# EasyEDA schematic SCH_Scheda_PSEIOT_2025-02-07.json
TITLE: Sheet_1; REV: 1.0; Date: 2024-11-25; Sheet: 1/1; Drawn By: steve.projects.lab; Company: Your Company
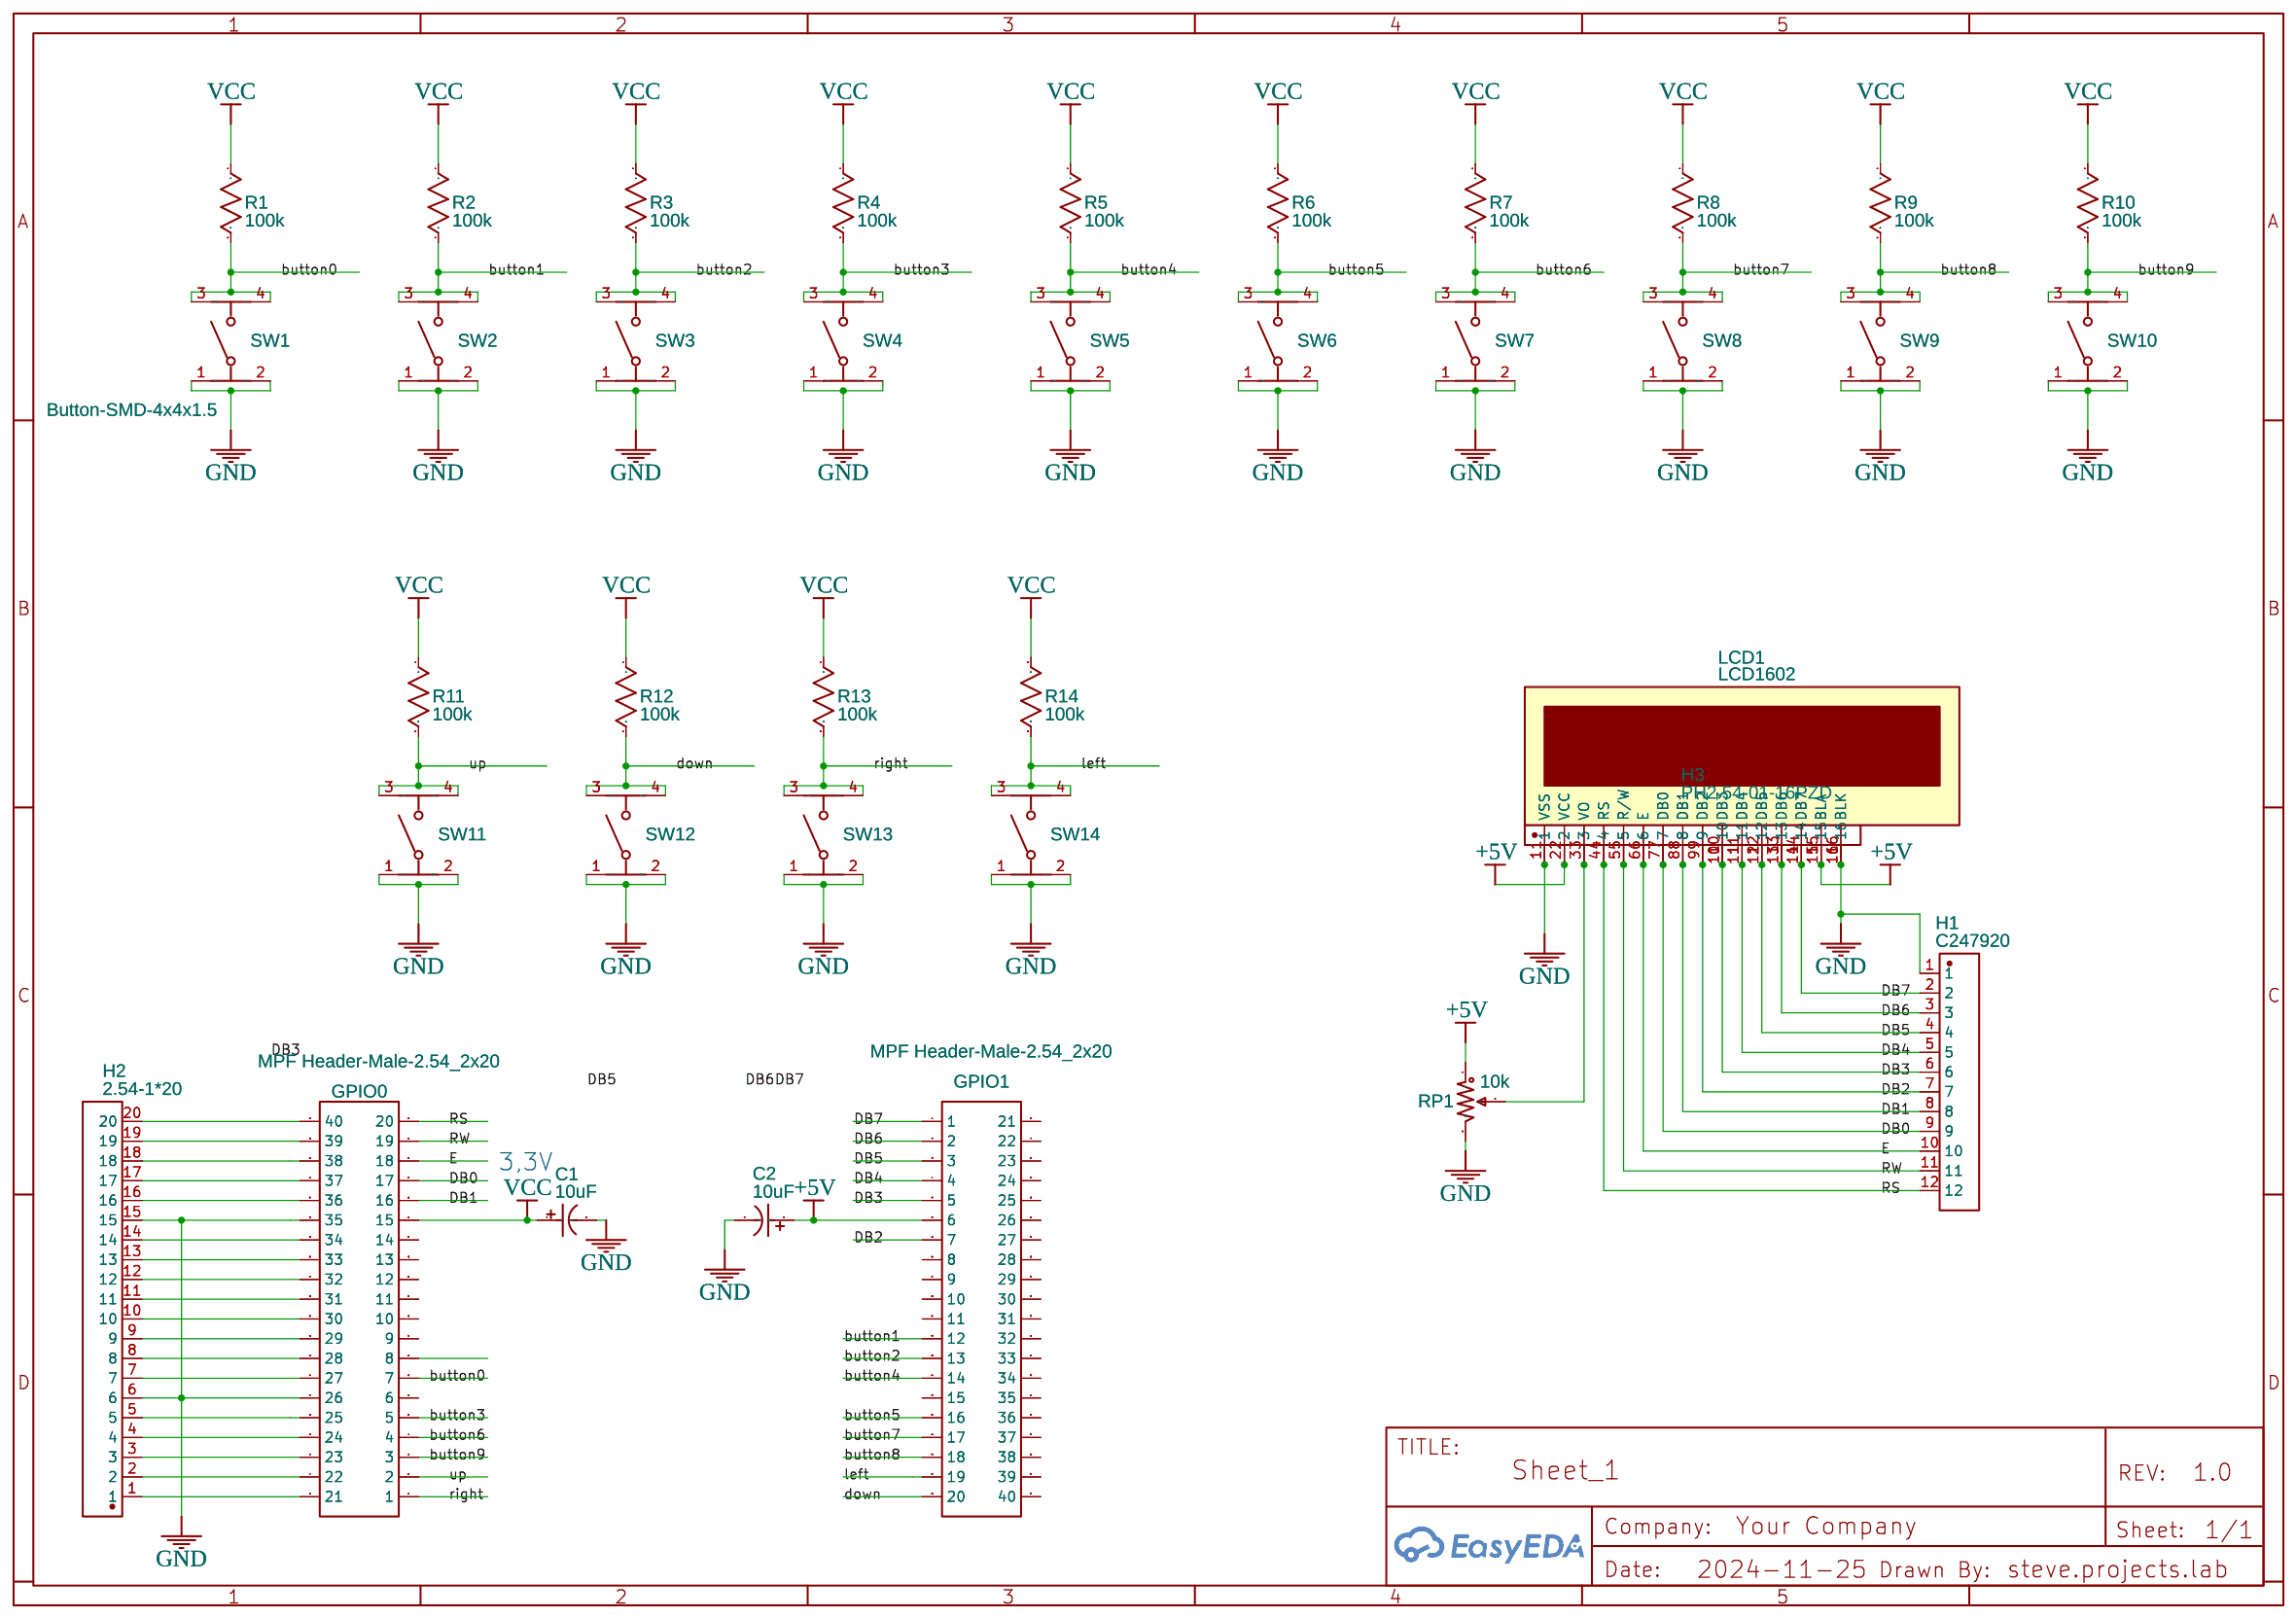
[diagram p0: schematic sheet]

## Parts
C1  10uF  [CAP-TH_BD5.0-P2.5-D0.5-FD]
C2  10uF  [CAP-TH_BD5.0-P2.5-D0.5-FD]
GPIO0  MPF Header-Male-2.54_2x20  [HDR-TH_40PIN-V-ROW2-COL20-FEMALE-PITCH2.54]
GPIO1  MPF Header-Male-2.54_2x20  [HDR-TH_40PIN-V-ROW2-COL20-FEMALE-PITCH2.54]
H1  C247920  [HDR-TH_12P-P2.54-H-M-W10.5]
H2  2.54-1*20  [HDR-TH_20P-P2.54-V-M]
H3  PH2.54-01-16PZD  [HDR-TH_16P-P2.54-V-M]
LCD1  LCD1602  [LCD1602]
R1  100k  [R0805]
R2  100k  [R0805]
R3  100k  [R0805]
R4  100k  [R0805]
R5  100k  [R0805]
R6  100k  [R0805]
R7  100k  [R0805]
R8  100k  [R0805]
R9  100k  [R0805]
R10  100k  [R0805]
R11  100k  [R0805]
R12  100k  [R0805]
R13  100k  [R0805]
R14  100k  [R0805]
RP1  10k  [RES-ADJ-TH_3296W]
SW1  Button-SMD-4x4x1.5  [SW-SMD_4P-L5.2-W5.2-P3.70-LS6.5]
SW2  Button-SMD-4x4x1.5  [SW-SMD_4P-L5.2-W5.2-P3.70-LS6.5]
SW3  Button-SMD-4x4x1.5  [SW-SMD_4P-L5.2-W5.2-P3.70-LS6.5]
SW4  Button-SMD-4x4x1.5  [SW-SMD_4P-L5.2-W5.2-P3.70-LS6.5]
SW5  Button-SMD-4x4x1.5  [SW-SMD_4P-L5.2-W5.2-P3.70-LS6.5]
SW6  Button-SMD-4x4x1.5  [SW-SMD_4P-L5.2-W5.2-P3.70-LS6.5]
SW7  Button-SMD-4x4x1.5  [SW-SMD_4P-L5.2-W5.2-P3.70-LS6.5]
SW8  Button-SMD-4x4x1.5  [SW-SMD_4P-L5.2-W5.2-P3.70-LS6.5]
SW9  Button-SMD-4x4x1.5  [SW-SMD_4P-L5.2-W5.2-P3.70-LS6.5]
SW10  Button-SMD-4x4x1.5  [SW-SMD_4P-L5.2-W5.2-P3.70-LS6.5]
SW11  Button-SMD-4x4x1.5  [SW-SMD_4P-L5.2-W5.2-P3.70-LS6.5]
SW12  Button-SMD-4x4x1.5  [SW-SMD_4P-L5.2-W5.2-P3.70-LS6.5]
SW13  Button-SMD-4x4x1.5  [SW-SMD_4P-L5.2-W5.2-P3.70-LS6.5]
SW14  Button-SMD-4x4x1.5  [SW-SMD_4P-L5.2-W5.2-P3.70-LS6.5]

## Library data of the parts
C1 C2 = C10uF63V2.5mm5x11mm: Supplier: LCSC; Manufacturer Part: KM106M063D11RR0VH2FP0; Manufacturer: CX(承兴); Supplier Part: C32455; JLCPCB Part Class: Extended Part
GPIO0 GPIO1 = MPF Header-Male-2.54_2x20: Supplier: LCSC; Manufacturer: BOOMELE; Manufacturer Part: 2.54mm 2*20P male header; image: //image.lceda.cn/szlcsc/C50982.jpg; Supplier Part: C50982; Contributor: Rubber_BeQi
H1 = C247920: Contributor: LCSC; Supplier: LCSC; Manufacturer: BOOMELE(博穆精密); Manufacturer Part: 2.54-1*12P反弯针; JLCPCB Part Class: Extended Part
H2 = 2.54-1*20: Contributor: lcsc; Supplier: LCSC; Supplier Part: C5156618; Manufacturer: ZHOURI(洲日); JLCPCB Part Class: Extended Part
H3 = PH2.54-01-16PZD: Supplier: LCSC; Supplier Part: C7501590; Manufacturer: XUNPU(讯普); JLCPCB Part Class: Extended Part; Contributor: lcsc
LCD1 = LCD1602: Manufacturer: LONTECH(厦门龙特); Manufacturer Part: LCM1602K-NSW-BBW; Supplier Part: C83275; Supplier: LCSC; Contributor: LCEDA_Lib
R1-R14 = R_0805_US: Contributor: LCEDA_Lib
RP1 = R_3296W_US: Supplier: LCSC; Contributor: LCEDA_Lib; value(Ω): 10K
SW1-SW14 = Button-SMD-4x4x1.5: Supplier Part: C71830; Supplier: LCSC; Manufacturer: BBJ; Manufacturer Part: 4*4*1.5Copper head,260G, 0.25mm,

## Nets
+5V: C2.1 GPIO1.11(6) H3.2 H3.15 LCD1.2(VCC) LCD1.15(BLA) RP1.1
GND: C1.2 C2.2 GPIO0.12(26) GPIO0.30(35) H1.1 H2.6 H2.15 H3.1 H3.16 LCD1.1(VSS) LCD1.16(BLK) RP1.3 SW1.1 SW1.2 SW2.1 SW2.2 SW3.1 SW3.2 SW4.1 SW4.2 SW5.1 SW5.2 SW6.1 SW6.2 SW7.1 SW7.2 SW8.1 SW8.2 SW9.1 SW9.2 SW10.1 SW10.2 SW11.1 SW11.2 SW12.1 SW12.2 SW13.1 SW13.2 SW14.1 SW14.2
VCC: C1.1 GPIO0.29(15) R1.1 R2.1 R3.1 R4.1 R5.1 R6.1 R7.1 R8.1 R9.1 R10.1 R11.1 R12.1 R13.1 R14.1
button0: GPIO0.13(7) R1.2 SW1.3 SW1.4
button1: GPIO1.23(12) R2.2 SW2.3 SW2.4
button2: GPIO1.25(13) R3.2 SW3.3 SW3.4
button3: GPIO0.9(5) R4.2 SW4.3 SW4.4
button4: GPIO1.27(14) R5.2 SW5.3 SW5.4
button5: GPIO1.31(16) R6.2 SW6.3 SW6.4
button6: GPIO0.7(4) R7.2 SW7.3 SW7.4
button7: GPIO1.33(17) R8.2 SW8.3 SW8.4
button8: GPIO1.35(18) R9.2 SW9.3 SW9.4
button9: GPIO0.5(3) R10.2 SW10.3 SW10.4
DB0: GPIO0.33(17) H1.9 H3.7 LCD1.7(DB0)
DB1: GPIO0.31(16) H1.8 H3.8 LCD1.8(DB1)
DB2: GPIO1.13(7) H1.7 H3.9 LCD1.9(DB2)
DB3: GPIO1.9(5) H1.6 H3.10 LCD1.10(DB3)
DB4: GPIO1.7(4) H1.5 H3.11 LCD1.11(DB4)
DB5: GPIO1.5(3) H1.4 H3.12 LCD1.12(DB5)
DB6: GPIO1.3(2) H1.3 H3.13 LCD1.13(DB6)
DB7: GPIO1.1 H1.2 H3.14 LCD1.14(DB7)
down: GPIO1.39(20) R12.2 SW12.3 SW12.4
E: GPIO0.35(18) H1.10 H3.6 LCD1.6(E)
left: GPIO1.37(19) R14.2 SW14.3 SW14.4
right: GPIO0.1 R13.2 SW13.3 SW13.4
RS: GPIO0.39(20) H1.12 H3.4 LCD1.4(RS)
RW: GPIO0.37(19) H1.11 H3.5 LCD1.5(R/W)
up: GPIO0.3(2) R11.2 SW11.3 SW11.4
Net-(GPIO0-2): GPIO0.2(21) H2.1
Net-(GPIO0-4): GPIO0.4(22) H2.2
Net-(GPIO0-6): GPIO0.6(23) H2.3
Net-(GPIO0-8): GPIO0.8(24) H2.4
Net-(GPIO0-10): GPIO0.10(25) H2.5
Net-(GPIO0-14): GPIO0.14(27) H2.7
Net-(GPIO0-16): GPIO0.16(28) H2.8
Net-(GPIO0-18): GPIO0.18(29) H2.9
Net-(GPIO0-20): GPIO0.20(30) H2.10
Net-(GPIO0-22): GPIO0.22(31) H2.11
Net-(GPIO0-24): GPIO0.24(32) H2.12
Net-(GPIO0-26): GPIO0.26(33) H2.13
Net-(GPIO0-28): GPIO0.28(34) H2.14
Net-(GPIO0-32): GPIO0.32(36) H2.16
Net-(GPIO0-34): GPIO0.34(37) H2.17
Net-(GPIO0-36): GPIO0.36(38) H2.18
Net-(GPIO0-38): GPIO0.38(39) H2.19
Net-(GPIO0-40): GPIO0.40 H2.20
Net-(H3-3): H3.3 LCD1.3(VO) RP1.2

Not connected (* = marked no-connect by the designer): GPIO0 11(6) 15(8) 17(9) 19(10) 21(11) 23(12) 25(13) 27(14); GPIO1 2(21) 4(22) 6(23) 8(24) 10(25) 12(26) 14(27) 15(8) 16(28) 17(9) 18(29) 19(10) 20(30) 21(11) 22(31) 24(32) 26(33) 28(34) 29(15) 30(35) 32(36) 34(37) 36(38) 38(39) 40

## Notes on the sheet
- 3,3V
